# EasyEDA schematic Sheet_3.json
TITLE: Display control; REV: 1.0; Date: 2025-06-03; Sheet: 3/4; Drawn By: ILIAS ILIOPOULOS; Company: fryktoria.com
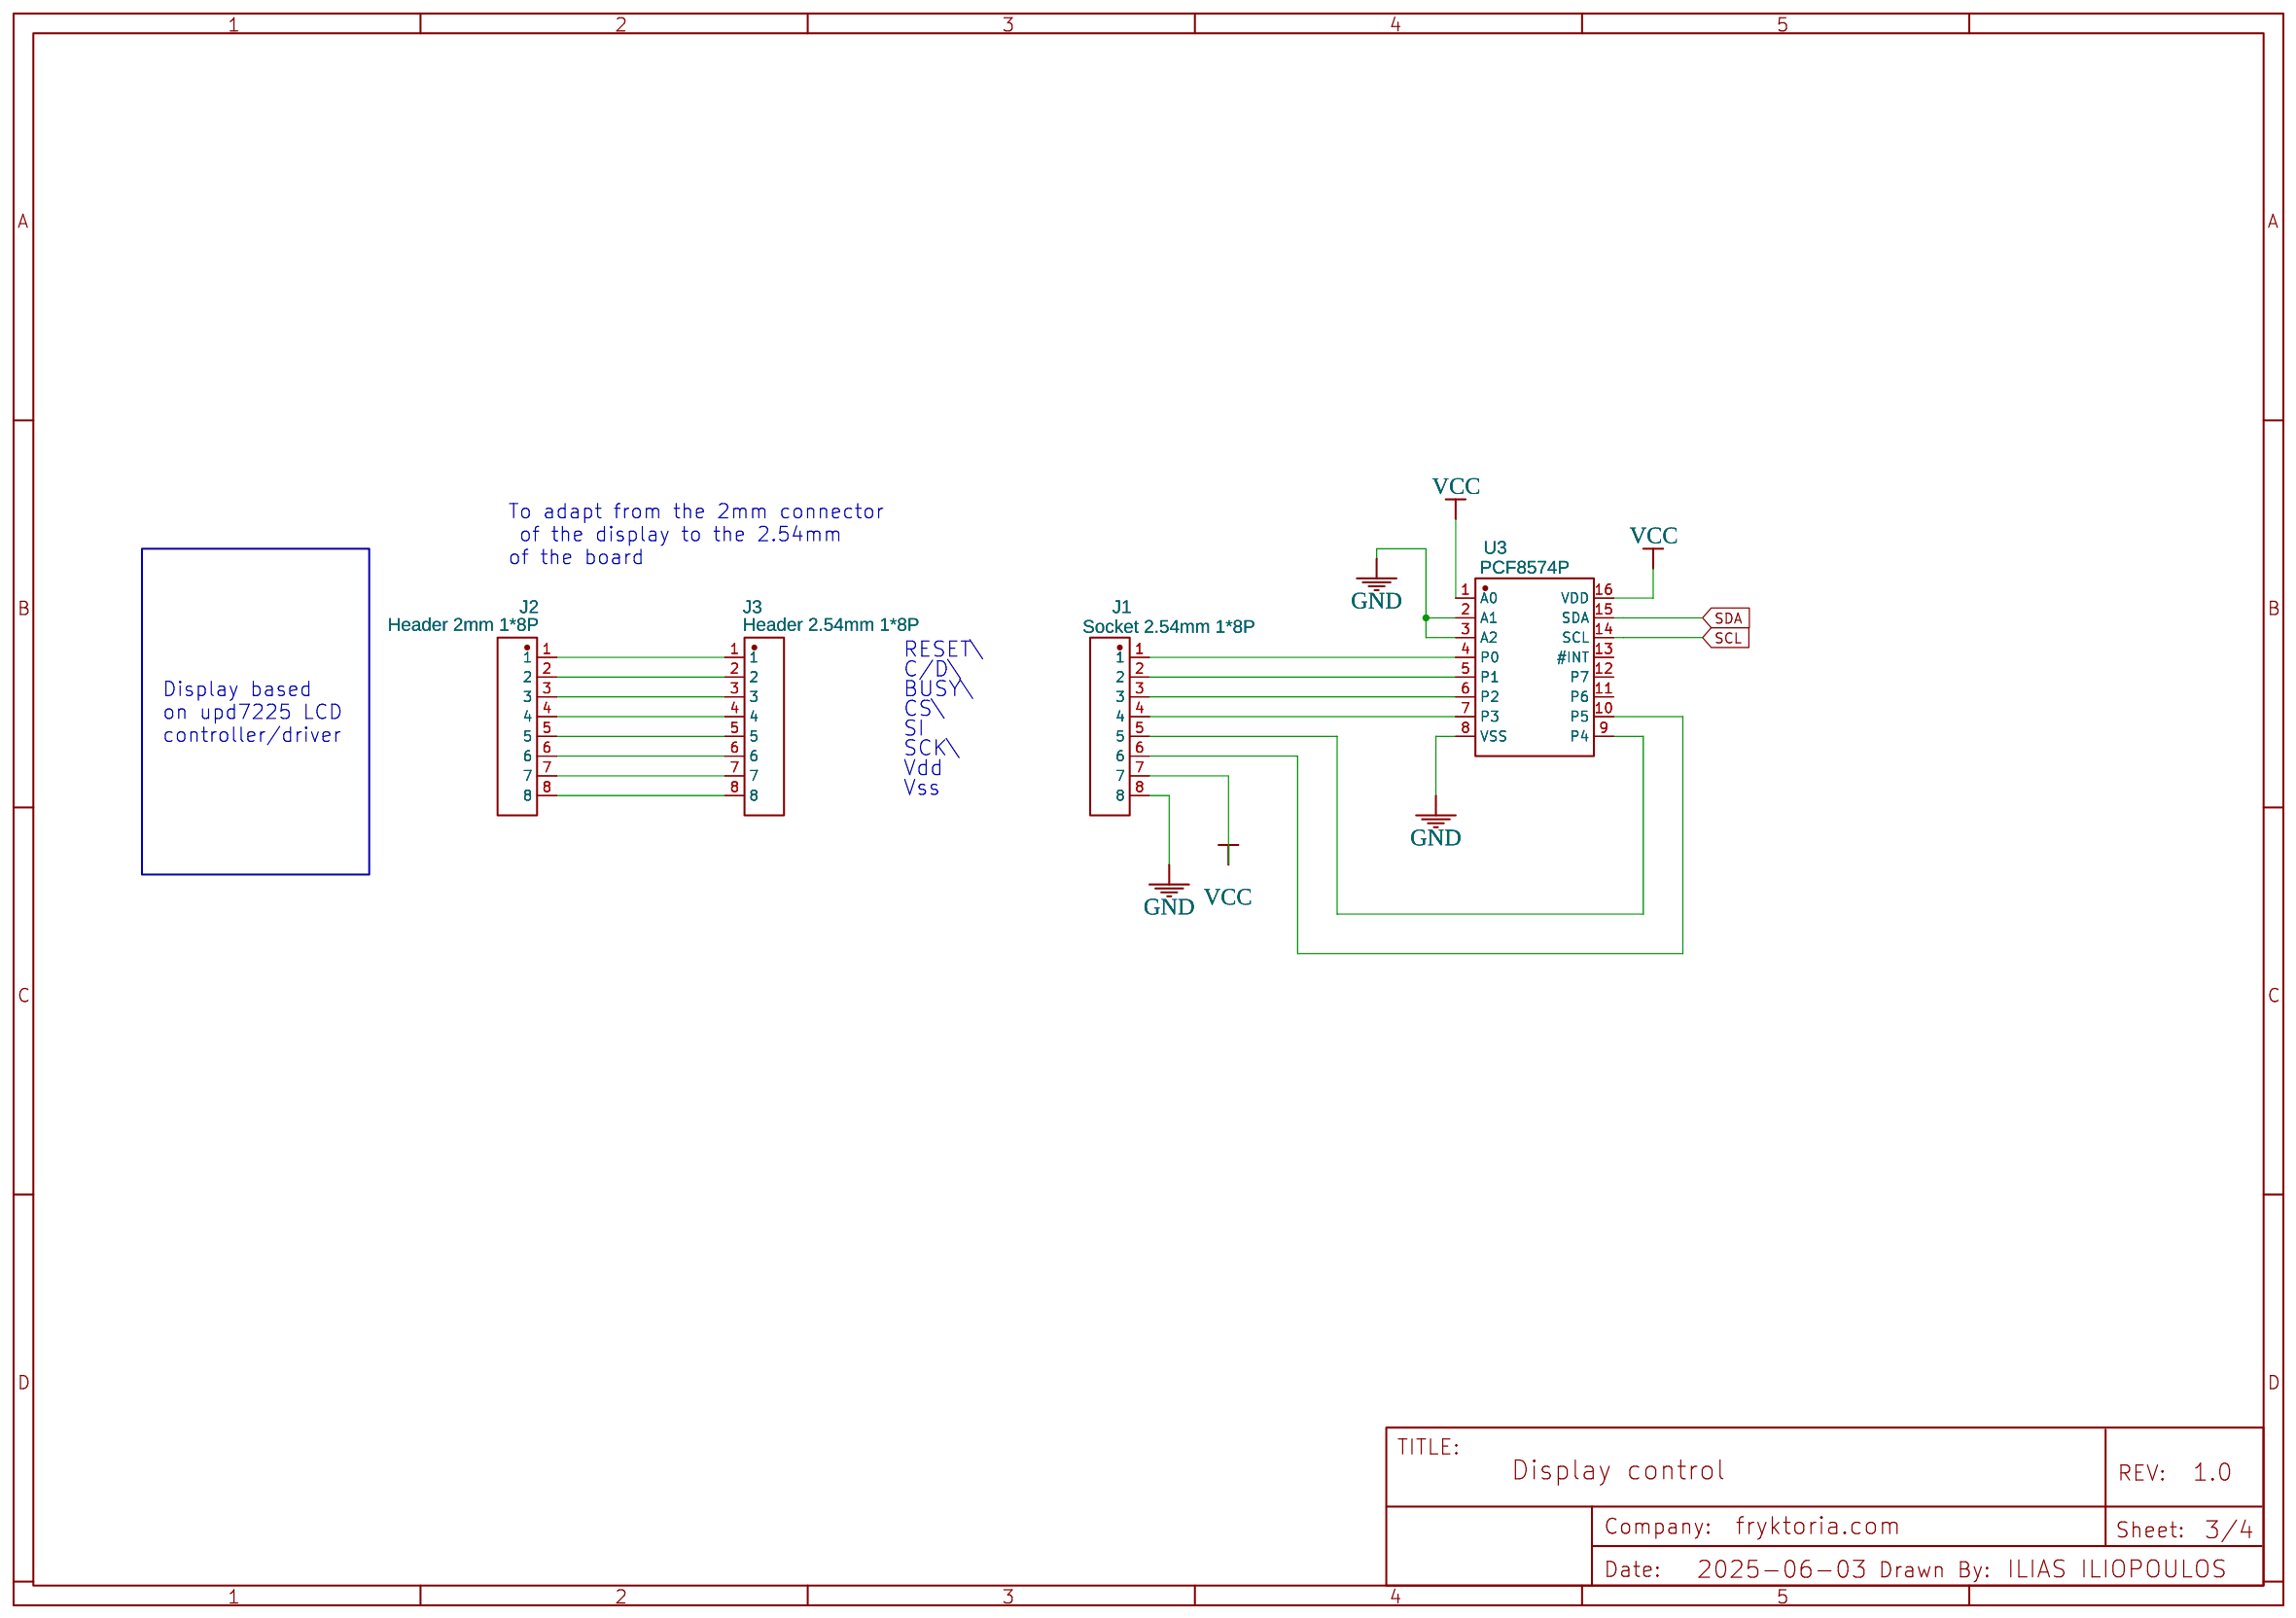
[diagram p0: schematic sheet]

## Parts
J1  Socket 2.54mm 1*8P  [HDR-TH_8P-P2.54-V-M]
J2  Header 2mm 1*8P  [HDR-TH_8P-P2.54-V-M]
J3  Header 2.54mm 1*8P  [HDR-TH_8P-P2.54-V-M]
U3  PCF8574P  [DIP-16_L19.3-W6.4-P2.54-LS7.6-BL]

## Library data of the parts
J1-J3 = Header2.54mm 1*8P: Supplier Part: C49256; Supplier: LCSC; Manufacturer: ReliaPro
U3 = PCF8574P: Contributor: LCSC; Supplier: LCSC; Supplier Part: C398073; Manufacturer: HGSEMI(华冠); JLCPCB Part Class: Extended Part

## Nets
GND: J1.8 U3.2(A1) U3.3(A2) U3.8(VSS)
VCC: J1.7 U3.1(A0) U3.16(VDD)
SCL: U3.14(SCL)
SDA: U3.15(SDA)
Net-(J1-1): J1.1 U3.4(P0)
Net-(J1-2): J1.2 U3.5(P1)
Net-(J1-3): J1.3 U3.6(P2)
Net-(J1-4): J1.4 U3.7(P3)
Net-(J1-5): J1.5 U3.9(P4)
Net-(J1-6): J1.6 U3.10(P5)
Net-(J2-1): J2.1 J3.1
Net-(J2-2): J2.2 J3.2
Net-(J2-3): J2.3 J3.3
Net-(J2-4): J2.4 J3.4
Net-(J2-5): J2.5 J3.5
Net-(J2-6): J2.6 J3.6
Net-(J2-7): J2.7 J3.7
Net-(J2-8): J2.8 J3.8

Not connected (* = marked no-connect by the designer): U3 11(P6) 12(P7) 13(#INT)

## Notes on the sheet
- To adapt from the 2mm connector
   of the display to the 2.54mm
  of the board
- RESET\
- C/D\
- Display based
  on upd7225 LCD
  controller/driver
- BUSY\
- CS\
- SI
- SCK\
- Vdd
- Vss
